# Altium schematic sheet PowerSwitch.SchDoc
size A
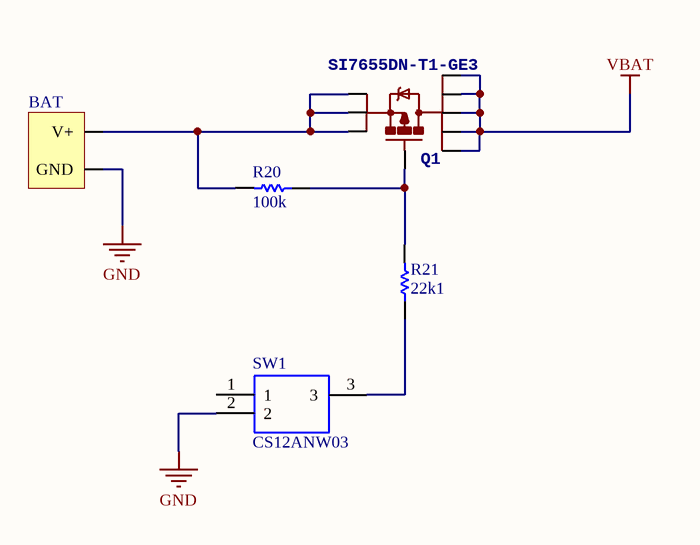
[diagram p0: PowerSwitch.SchDoc]

## Parts
BAT  XT60  [BATTERY_CONECTO-PCB]  (value not drawn)
Q1  SI7655DN-T1-GE3  [SON8]
R20  100k  [0402]
R21  22k1  [0402]
SW1  CS12ANW03  [CS12ANW03]

## Nets
GND: BAT.1(GND) SW1.2
VBAT: Q1.5(D) Q1.6(D) Q1.7(D) Q1.8(D) Q1.9(D)
NetBAT_0: BAT.0(V+) Q1.1(S) Q1.2(S) Q1.3(S) R20.2
NetQ1_4: Q1.4(G) R20.1 R21.2
NetR21_1: R21.1 SW1.3

Not connected (* = marked no-connect by the designer): SW1 1

## Library data of the parts
BAT = BATTERY_CONNECTOR: XT60 PRT-10474
Q1 = SI7655DN-T1-GE3-3: MOSFET P-CH 20V D-S PPAK 1212; Cod EMS: 05.284.001.520; Part No: SI7655DN-T1-GE3
R20 R21 = Res1: Resistor; Value: 4,7K; Published: 8-Jun-2000; LatestRevisionDate: 17-Jul-2002; LatestRevisionNote: Re-released for DXP Platform.; PackageReference: AXIAL-0.3; Publisher: Altium Limited; PackageDescription: Axial Device, Thru-Hole; 2 Leads; 0.3 in Pin Spacing
SW1 = CS12ANW03: NKK SWITCHES - CS12ANW03 - SWITCH, SLIDE, SPDT, 3A, 250V, TH; Allied_Number: 70228233; Manufacturer_Name: NKK Switches; Manufacturer_Part_Number: CS12ANW03; RS Part Number: 1251847; RS Price/Stock: http://uk.rs-online.com/web/p/products/1251847; Allied Price/Stock: https://www.alliedelec.com/nkk-switches-cs12anw03/70228233/; Arrow Part Number: CS12ANW03; Arrow Price/Stock: https://www.arrow.com/en/products/cs12anw03/nkk-switches; Datasheet Link: http://www.nkkswitches.com/pdf/cs.pdf